# Altium project HW_Z-BAND_SMART_AMP_R1.PrjPcb (part 3 of 4)

## Sheet 09_USB.SchDoc: =TitleParameter
size A3; Date: 6/12/2026; ApprovedBy: U.KAYACIK; CheckedBy: E. CAGLAV; DrawnBy: E. CAGLAV; Organization: ASISGUARD; Address1: Kemalpasa, Kemalpasa Cd. No:290 D:292H, 35060 Bornova/Izmir/Turkey; Revision: R1; SheetNumber: 9; SheetTotal: 12
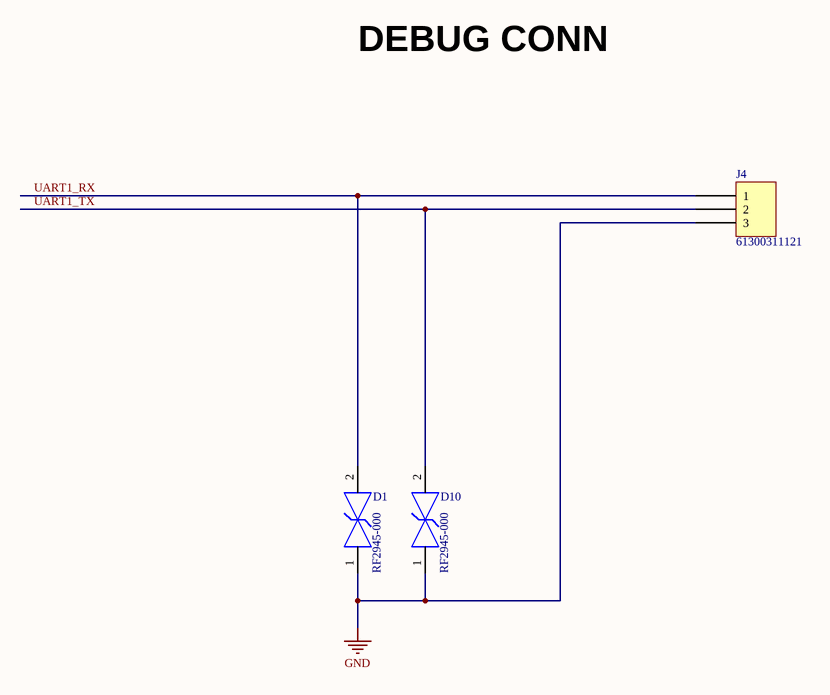
[diagram p8: 09_USB.SchDoc]

### Parts
D1  RF2945-000  [FP-SESD0402-MFG]
D10  RF2945-000  [FP-SESD0402-MFG]
J4  61300311121  [WURTH WE-PHD 61300311121]

### Nets
GND: D1.1 D10.1 J4.3
UART1_RX: D1.2 J4.1
UART1_TX: D10.2 J4.2

### Notes on the sheet
- DEBUG CONN
- Proje/Project:
- Sayfa Adı/Document Name:
- Çizilme Tarihi/Drawing Date
- E. CAGLAV
- Tasarlayan/Designed By
- Sayfa/Sheet:
- Revision:
- of
- Son Güncelleme/Last Edit Date
- Kontrol eden/Checked By
- Onaylayan/Approved By
- Boyut/Size:
- Varyant/Variant:
- Dil/Language:
- A3
- ENG

### Library data of the parts
D1 D10 = CMP-08607-000062-1: TVS DIODE 7V 10V 0402; Manufacturer: Littelfuse; Value: 0.1pF; Breakdown Voltage: 9.8V; Number Of Channels: 1; Peak Pulse Current: 2A; Direction: Bidirectional; Automotive Grade: Grade 1; Standoff Height: 0mm; Octopart: https://octopart.com/rf2945-000-littelfuse-56516902; Device Class L3: unset; ComponentLink2Description: Datasheet; Lead Free: Yes; Temperature Range Low: -55°C; Clamping Voltage: 10V; Digikey Description: TVS DIODE 7V 10V 0402; Category: Diode; Temperature: -55°C to +125°C; Device Class L1: Circuit Protection; Capacitance: 0.1pF; RoHS: TRUE; Device Class L2: TVS Diodes; Package: SESD0402; Reverse Standoff Voltage: 7V; Automotive: Yes; Height: 0.43mm; Manufacturer Part Number: RF2945-000; Temperature Range High: +125°C; ComponentLink2URL: https://www.littelfuse.com/~/media/electronics/datasheets/tvs_diode_arrays/littelfuse_tvs_diode_array_sesd_ultra_low_capacitance_discrete_tvs_datasheet.pdf.pdf
J4 = 61300311121: CONN HEADER VERT 3POS 2.54MM; Manufacturer: Würth Elektronik; Contact Length - Mating: 0.236" (6.00mm); Contact Length - Post: 0.118" (3.00mm); Current Rating (Amps): 3A; Material Flammability Rating: UL94 V-0; Number of Positions: 3; Number of Positions Loaded: All; Overall Contact Length: 0.454" (11.54mm); Pitch - Mating: 0.100" (2.54mm); Row Spacing - Mating: -40°C ~ 105°C; Shrouding: Unshrouded; Style: Board to Board or Cable; Part Number: 61300311121; ComponentLink1Description: Datasheet; ComponentLink1URL: https://katalog.we-online.de/em/datasheet/6130xx11121.pdf; ComponentLink2Description: DigiKey Link; ComponentLink2URL: https://www.digikey.com/en/products/detail/würth-elektronik/61300311121/4846825; Connector Type: Header; Contact Finish - Mating: Gold; Contact Material: Copper Alloy; Contact Shape: Square; Contact Type: Male Pin; Fastening Type: Push-Pull; Insulation Color: Black; Insulation Height: 0.100" (2.54mm); Insulation Material: Polyamide (PA6T), Nylon 6T; LastUpdated: 10/18/2024 1:43:15 PM; Lifecycle Status: Active; Minimum Order: 1; Mounting Type: Through Hole; Number of Rows: 1; Operating Temperature: -40°C ~ 105°C; Packaging: Bulk; PartId: 189; Part Status: Active; Price: 0.07; Series: WR-PHD; Supplier 1: DigiKey; Supplier Part Number 1: 732-5316-ND; Termination: Solder

## Sheet 10_RF_1.SchDoc: =TitleParameter
size A2; Date: 6/12/2026; ApprovedBy: U.KAYACIK; CheckedBy: E. CAGLAV; DrawnBy: E. CAGLAV; Revision: R1; SheetNumber: 10; SheetTotal: 12
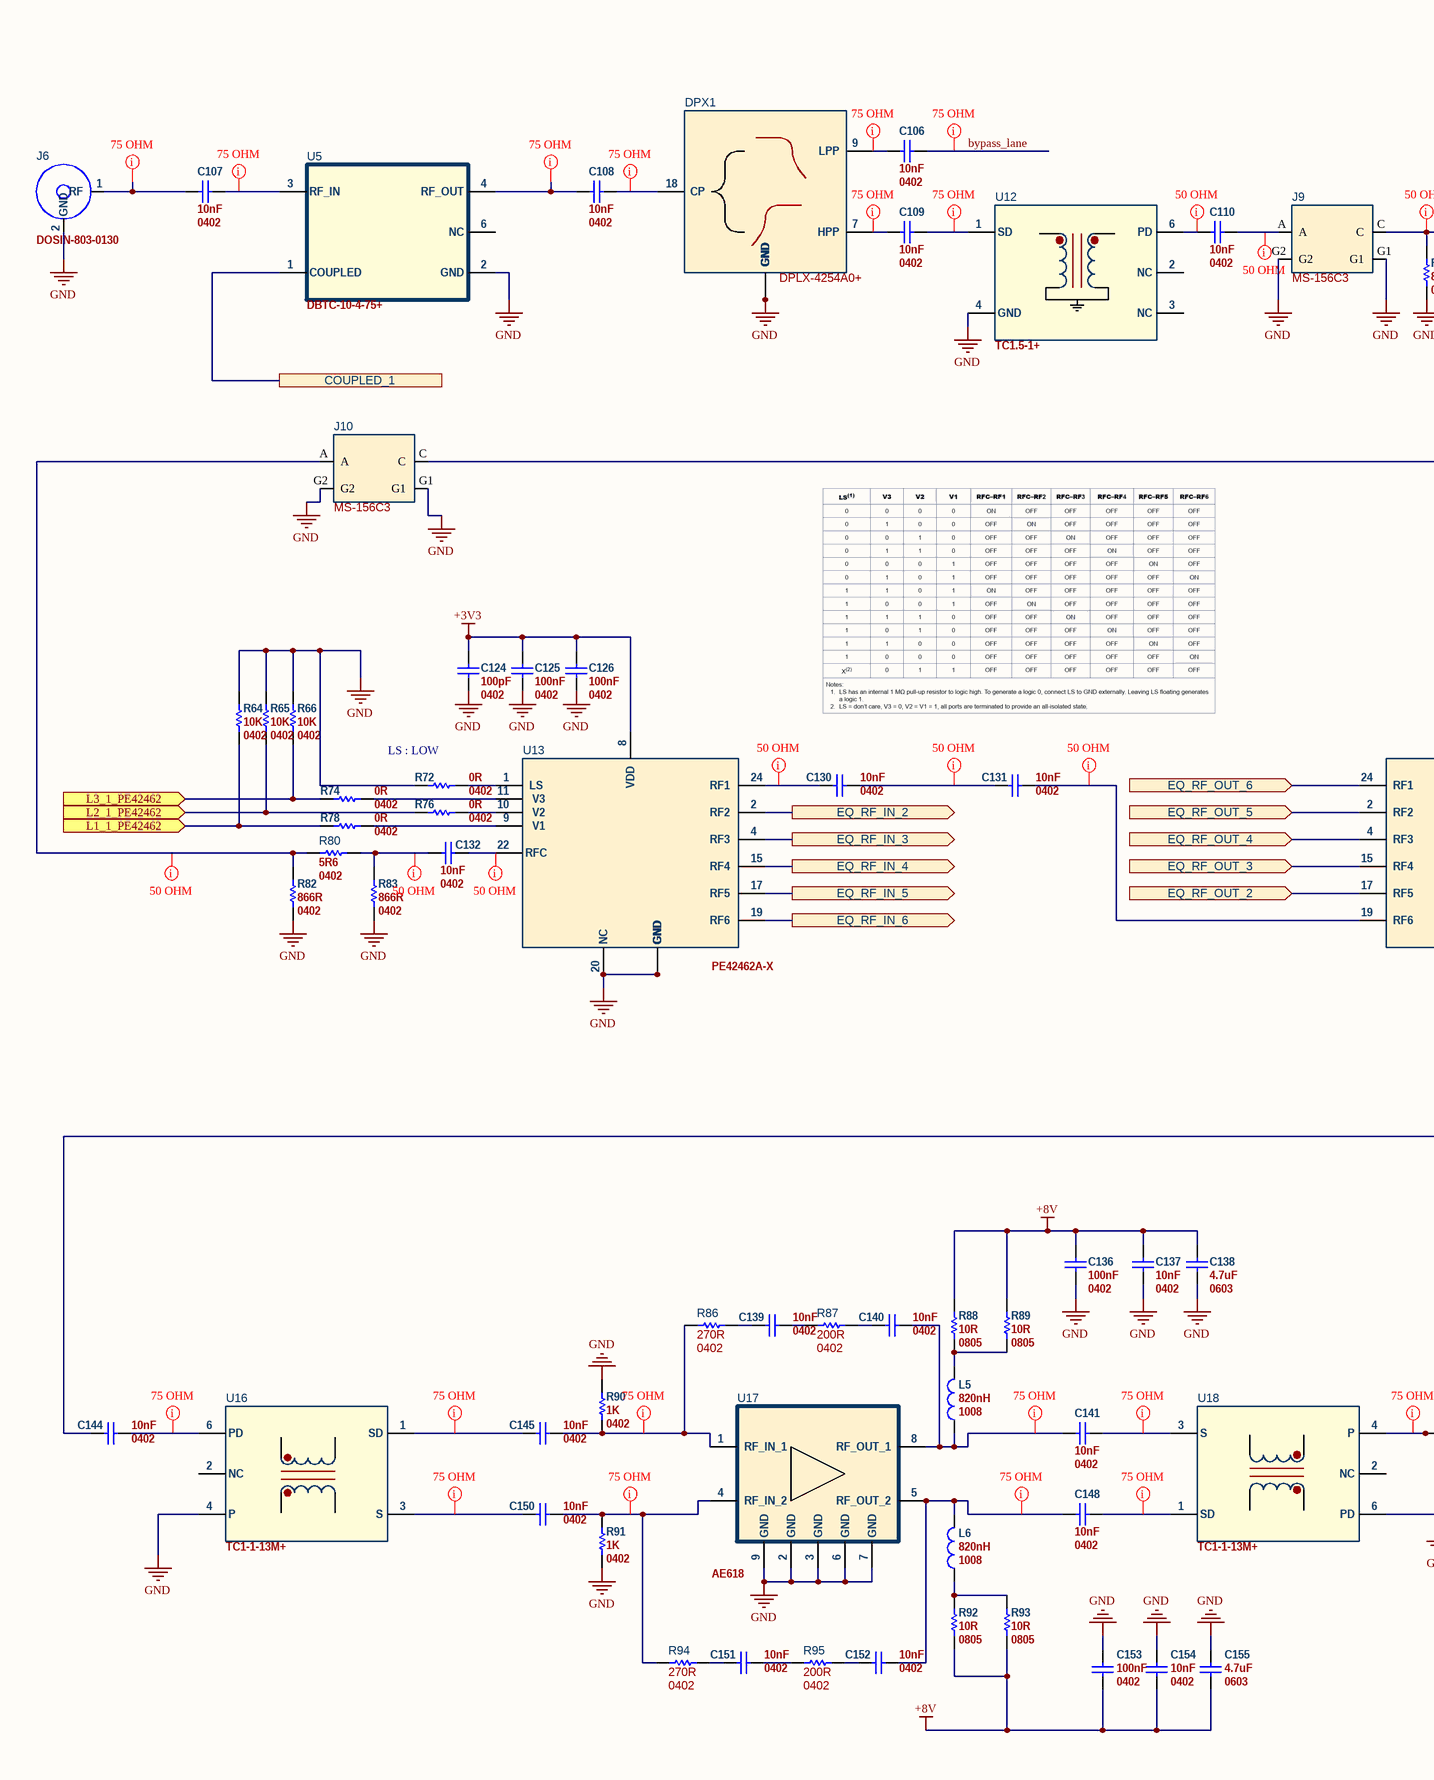
[diagram p9: 10_RF_1.SchDoc, left]
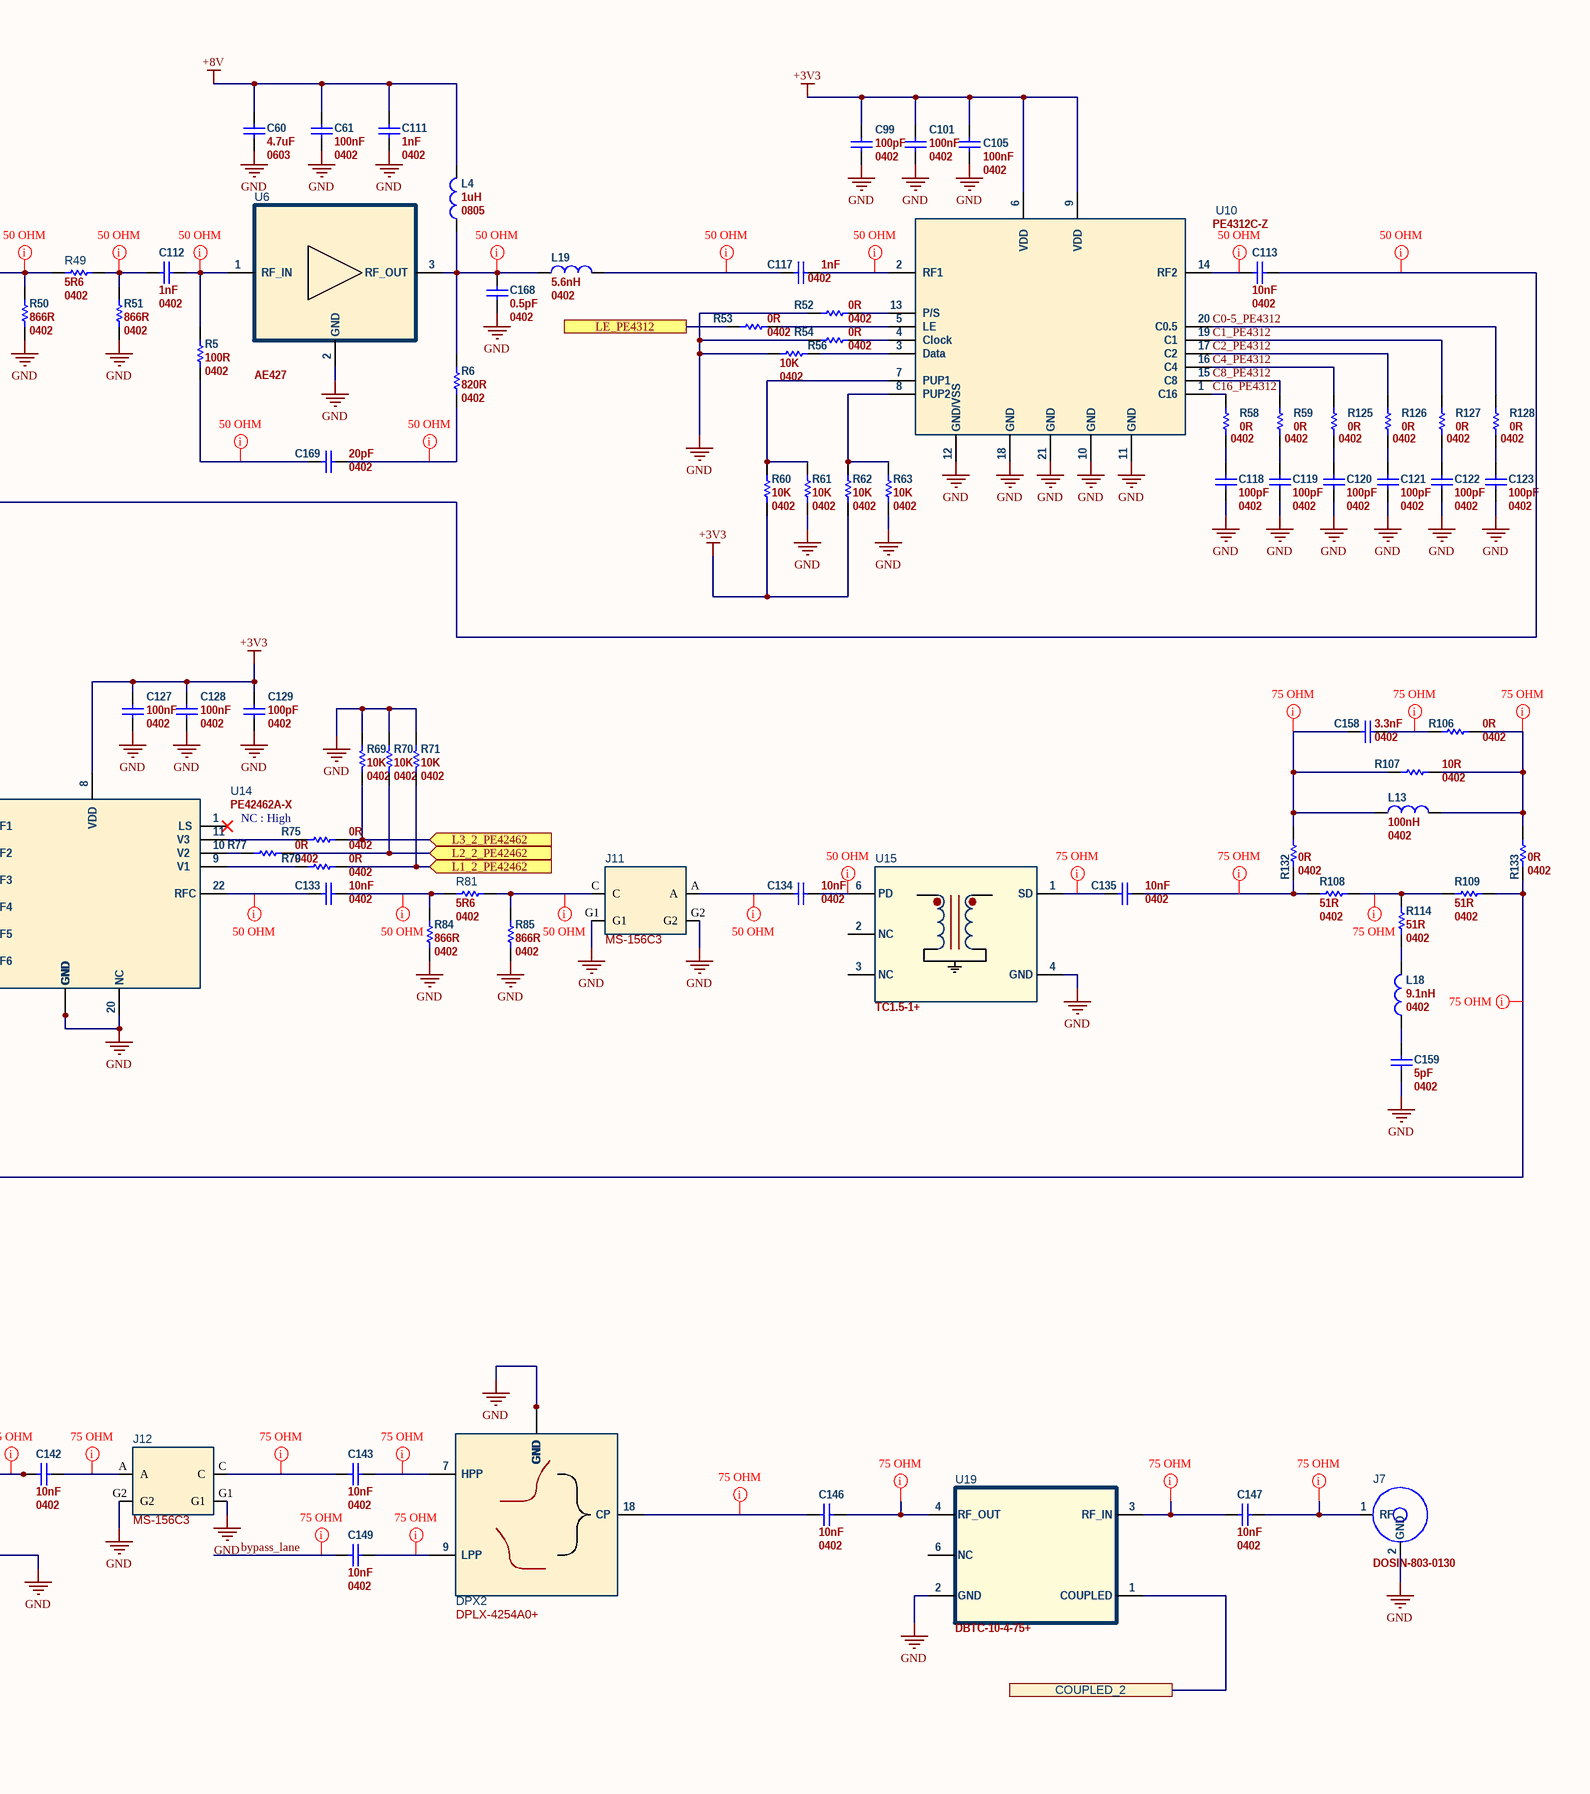
[diagram p10: 10_RF_1.SchDoc, right]

### Parts
C60  value 4.7uF  Package: 0603  [CAP_0603_N]  (hidden comment: C 0603 16V X7R - 4.7uF)
C61  value 100nF  Package: 0402  [CAP_0402_N]  (hidden comment: C 0402 50V X7R - 100nF)
C99  value 100pF  Package: 0402  [CAP_0402_N]  (hidden comment: C 0402 50V NP0 - 100pF)
C101  value 100nF  Package: 0402  [CAP_0402_N]  (hidden comment: C 0402 50V X7R - 100nF)
C105  value 100nF  Package: 0402  [CAP_0402_N]  (hidden comment: C 0402 50V X7R - 100nF)
C106  value 10nF  Package: 0402  [CAP_0402_N]  (hidden comment: C 0402 50V X7R - 10nF)
C107  value 10nF  Package: 0402  [CAP_0402_N]  (hidden comment: C 0402 50V X7R - 10nF)
C108  value 10nF  Package: 0402  [CAP_0402_N]  (hidden comment: C 0402 50V X7R - 10nF)
C109  value 10nF  Package: 0402  [CAP_0402_N]  (hidden comment: C 0402 50V X7R - 10nF)
C110  value 10nF  Package: 0402  [CAP_0402_N]  (hidden comment: C 0402 50V X7R - 10nF)
C111  value 1nF  Package: 0402  [CAP_0402_N]  (hidden comment: C 0402 50V X7R - 1nF)
C112  value 1nF  Package: 0402  [CAP_0402_N]  (hidden comment: C 0402 50V X7R - 1nF)
C113  value 10nF  Package: 0402  [CAP_0402_N]  (hidden comment: C 0402 50V X7R - 10nF)
C117  value 1nF  Package: 0402  [CAP_0402_N]  (hidden comment: C 0402 50V X7R - 1nF)
C118  value 100pF  Package: 0402  [CAP_0402_N]  (hidden comment: C 0402 50V NP0 - 100pF)
C119  value 100pF  Package: 0402  [CAP_0402_N]  (hidden comment: C 0402 50V NP0 - 100pF)
C120  value 100pF  Package: 0402  [CAP_0402_N]  (hidden comment: C 0402 50V NP0 - 100pF)
C121  value 100pF  Package: 0402  [CAP_0402_N]  (hidden comment: C 0402 50V NP0 - 100pF)
C122  value 100pF  Package: 0402  [CAP_0402_N]  (hidden comment: C 0402 50V NP0 - 100pF)
C123  value 100pF  Package: 0402  [CAP_0402_N]  (hidden comment: C 0402 50V NP0 - 100pF)
C124  value 100pF  Package: 0402  [CAP_0402_N]  (hidden comment: C 0402 50V NP0 - 100pF)
C125  value 100nF  Package: 0402  [CAP_0402_N]  (hidden comment: C 0402 50V X7R - 100nF)
C126  value 100nF  Package: 0402  [CAP_0402_N]  (hidden comment: C 0402 50V X7R - 100nF)
C127  value 100nF  Package: 0402  [CAP_0402_N]  (hidden comment: C 0402 50V X7R - 100nF)
C128  value 100nF  Package: 0402  [CAP_0402_N]  (hidden comment: C 0402 50V X7R - 100nF)
C129  value 100pF  Package: 0402  [CAP_0402_N]  (hidden comment: C 0402 50V NP0 - 100pF)
C130  value 10nF  Package: 0402  [CAP_0402_N]  (hidden comment: C 0402 50V X7R - 10nF)
C131  value 10nF  Package: 0402  [CAP_0402_N]  (hidden comment: C 0402 50V X7R - 10nF)
C132  value 10nF  Package: 0402  [CAP_0402_N]  (hidden comment: C 0402 50V X7R - 10nF)
C133  value 10nF  Package: 0402  [CAP_0402_N]  (hidden comment: C 0402 50V X7R - 10nF)
C134  value 10nF  Package: 0402  [CAP_0402_N]  (hidden comment: C 0402 50V X7R - 10nF)
C135  value 10nF  Package: 0402  [CAP_0402_N]  (hidden comment: C 0402 50V X7R - 10nF)
C136  value 100nF  Package: 0402  [CAP_0402_N]  (hidden comment: C 0402 50V X7R - 100nF)
C137  value 10nF  Package: 0402  [CAP_0402_N]  (hidden comment: C 0402 50V X7R - 10nF)
C138  value 4.7uF  Package: 0603  [CAP_0603_N]  (hidden comment: C 0603 16V X7R - 4.7uF)
C139  value 10nF  Package: 0402  [CAP_0402_N]  (hidden comment: C 0402 50V X7R - 10nF)
C140  value 10nF  Package: 0402  [CAP_0402_N]  (hidden comment: C 0402 50V X7R - 10nF)
C141  value 10nF  Package: 0402  [CAP_0402_N]  (hidden comment: C 0402 50V X7R - 10nF)
C142  value 10nF  Package: 0402  [CAP_0402_N]  (hidden comment: C 0402 50V X7R - 10nF)
C143  value 10nF  Package: 0402  [CAP_0402_N]  (hidden comment: C 0402 50V X7R - 10nF)
C144  value 10nF  Package: 0402  [CAP_0402_N]  (hidden comment: C 0402 50V X7R - 10nF)
C145  value 10nF  Package: 0402  [CAP_0402_N]  (hidden comment: C 0402 50V X7R - 10nF)
C146  value 10nF  Package: 0402  [CAP_0402_N]  (hidden comment: C 0402 50V X7R - 10nF)
C147  value 10nF  Package: 0402  [CAP_0402_N]  (hidden comment: C 0402 50V X7R - 10nF)
C148  value 10nF  Package: 0402  [CAP_0402_N]  (hidden comment: C 0402 50V X7R - 10nF)
C149  value 10nF  Package: 0402  [CAP_0402_N]  (hidden comment: C 0402 50V X7R - 10nF)
C150  value 10nF  Package: 0402  [CAP_0402_N]  (hidden comment: C 0402 50V X7R - 10nF)
C151  value 10nF  Package: 0402  [CAP_0402_N]  (hidden comment: C 0402 50V X7R - 10nF)
C152  value 10nF  Package: 0402  [CAP_0402_N]  (hidden comment: C 0402 50V X7R - 10nF)
C153  value 100nF  Package: 0402  [CAP_0402_N]  (hidden comment: C 0402 50V X7R - 100nF)
C154  value 10nF  Package: 0402  [CAP_0402_N]  (hidden comment: C 0402 50V X7R - 10nF)
C155  value 4.7uF  Package: 0603  [CAP_0603_N]  (hidden comment: C 0603 16V X7R - 4.7uF)
C158  value 3.3nF  Package: 0402  [CAP_0402_N]  (hidden comment: C 0402 50V X7R - 3.3nF)
C159  value 5pF  Package: 0402  [CAP_0402_N]  (hidden comment: C 0402 50V C0G/NP0 - 5pF)
C168  value 0.5pF  Package: 0402  [CAP_0402_N]  (hidden comment: C 0402 50V C0G/NP0 - 0.5pF)
C169  value 20pF  Package: 0402  [CAP_0402_N]  (hidden comment: C 0402 50V C0G/NP0 - 20pF)
DPX1  DPLX-4254A0+  [NU-1620]
DPX2  DPLX-4254A0+  [NU-1620]
J6  DOSIN-803-0130  [1211-66137]
J7  DOSIN-803-0130  [1211-66137]
J9  MS-156C3  [HIROSE_MS-156C3]
J10  MS-156C3  [HIROSE_MS-156C3]
J11  MS-156C3  [HIROSE_MS-156C3]
J12  MS-156C3  [HIROSE_MS-156C3]
L4  value 1uH  Package: 0805  [IND_0806_LQH2MPN820MGRL]  (hidden comment: L 0805 800mA - 1uH)
L5  value 820nH  Package: 1008  [IND_1008_N]  (hidden comment: L 1008 400mA - 820nH)
L6  value 820nH  Package: 1008  [IND_1008_N]  (hidden comment: L 1008 400mA - 820nH)
L13  value 100nH  Package: 0402  [IND_0402_N]  (hidden comment: L 0402 310mA - 100nH)
L18  value 9.1nH  Package: 0402  [IND_0402_N]  (hidden comment: L 0402 1.6A - 9.1nH)
L19  value 5.6nH  Package: 0402  [IND_0402_N]  (hidden comment: L 0402 650mA - 5.6nH)
R5  value 100R  Package: 0402  [RES_0402_N]  (hidden comment: R 0402 1/10W 1% - 100R)
R6  value 820R  Package: 0402  [RES_0402_N]  (hidden comment: R 0402 1/10W 1% - 820R)
R49  value 5R6  Package: 0402  [RES_0402_N]  (hidden comment: R 0402 1/10W 1% - 5R6)
R50  value 866R  Package: 0402  [RES_0402_N]  (hidden comment: R 0402 1/10W 1% - 866R)
R51  value 866R  Package: 0402  [RES_0402_N]  (hidden comment: R 0402 1/10W 1% - 866R)
R52  value 0R  Package: 0402  [RES_0402_N]  (hidden comment: R 0402 1/10W - 0R)
R53  value 0R  Package: 0402  [RES_0402_N]  (hidden comment: R 0402 1/10W - 0R)
R54  value 0R  Package: 0402  [RES_0402_N]  (hidden comment: R 0402 1/10W - 0R)
R56  value 10K  Package: 0402  [RES_0402_N]  (hidden comment: R 0402 1/10W 1% - 10K)
R58  value 0R  Package: 0402  [RES_0402_N]  (hidden comment: R 0402 1/10W - 0R)
R59  value 0R  Package: 0402  [RES_0402_N]  (hidden comment: R 0402 1/10W - 0R)
R60  value 10K  Package: 0402  [RES_0402_N]  (hidden comment: R 0402 1/10W 1% - 10K)
R61  value 10K  Package: 0402  [RES_0402_N]  (hidden comment: R 0402 1/10W 1% - 10K)
R62  value 10K  Package: 0402  [RES_0402_N]  (hidden comment: R 0402 1/10W 1% - 10K)
R63  value 10K  Package: 0402  [RES_0402_N]  (hidden comment: R 0402 1/10W 1% - 10K)
R64  value 10K  Package: 0402  [RES_0402_N]  (hidden comment: R 0402 1/10W 1% - 10K)
R65  value 10K  Package: 0402  [RES_0402_N]  (hidden comment: R 0402 1/10W 1% - 10K)
R66  value 10K  Package: 0402  [RES_0402_N]  (hidden comment: R 0402 1/10W 1% - 10K)
R69  value 10K  Package: 0402  [RES_0402_N]  (hidden comment: R 0402 1/10W 1% - 10K)
R70  value 10K  Package: 0402  [RES_0402_N]  (hidden comment: R 0402 1/10W 1% - 10K)
R71  value 10K  Package: 0402  [RES_0402_N]  (hidden comment: R 0402 1/10W 1% - 10K)
R72  value 0R  Package: 0402  [RES_0402_N]  (hidden comment: R 0402 1/10W - 0R)
R74  value 0R  Package: 0402  [RES_0402_N]  (hidden comment: R 0402 1/10W - 0R)
R75  value 0R  Package: 0402  [RES_0402_N]  (hidden comment: R 0402 1/10W - 0R)
R76  value 0R  Package: 0402  [RES_0402_N]  (hidden comment: R 0402 1/10W - 0R)
R77  value 0R  Package: 0402  [RES_0402_N]  (hidden comment: R 0402 1/10W - 0R)
R78  value 0R  Package: 0402  [RES_0402_N]  (hidden comment: R 0402 1/10W - 0R)
R79  value 0R  Package: 0402  [RES_0402_N]  (hidden comment: R 0402 1/10W - 0R)
R80  value 5R6  Package: 0402  [RES_0402_N]  (hidden comment: R 0402 1/10W 1% - 5R6)
R81  value 5R6  Package: 0402  [RES_0402_N]  (hidden comment: R 0402 1/10W 1% - 5R6)
R82  value 866R  Package: 0402  [RES_0402_N]  (hidden comment: R 0402 1/10W 1% - 866R)
R83  value 866R  Package: 0402  [RES_0402_N]  (hidden comment: R 0402 1/10W 1% - 866R)
R84  value 866R  Package: 0402  [RES_0402_N]  (hidden comment: R 0402 1/10W 1% - 866R)
R85  value 866R  Package: 0402  [RES_0402_N]  (hidden comment: R 0402 1/10W 1% - 866R)
R86  value 270R  Package: 0402  [RES_0402_N]  (hidden comment: R 0402 1/10W 1% - 270R)
R87  value 200R  Package: 0402  [RES_0402_N]  (hidden comment: R 0402 1/10W 1% - 200R)
R88  value 10R  Package: 0805  [RES_0805_N]  (hidden comment: R 0805 1/2W 1% - 10R)
R89  value 10R  Package: 0805  [RES_0805_N]  (hidden comment: R 0805 1/2W 1% - 10R)
R90  value 1K  Package: 0402  [RES_0402_N]  (hidden comment: R 0402 1/10W 1% - 1K)
R91  value 1K  Package: 0402  [RES_0402_N]  (hidden comment: R 0402 1/10W 1% - 1K)
R92  value 10R  Package: 0805  [RES_0805_N]  (hidden comment: R 0805 1/2W 1% - 10R)
R93  value 10R  Package: 0805  [RES_0805_N]  (hidden comment: R 0805 1/2W 1% - 10R)
R94  value 270R  Package: 0402  [RES_0402_N]  (hidden comment: R 0402 1/10W 1% - 270R)
R95  value 200R  Package: 0402  [RES_0402_N]  (hidden comment: R 0402 1/10W 1% - 200R)
R106  value 0R  Package: 0402  [RES_0402_N]  (hidden comment: R 0402 1/10W - 0R)
R107  value 10R  Package: 0402  [RES_0402_N]  (hidden comment: R 0402 1/10W 1% - 10R)
R108  value 51R  Package: 0402  [RES_0402_N]  (hidden comment: R 0402 1/10W 1% - 51R)
R109  value 51R  Package: 0402  [RES_0402_N]  (hidden comment: R 0402 1/10W 1% - 51R)
R114  value 51R  Package: 0402  [RES_0402_N]  (hidden comment: R 0402 1/10W 1% - 51R)
R125  value 0R  Package: 0402  [RES_0402_N]  (hidden comment: R 0402 1/10W - 0R)
R126  value 0R  Package: 0402  [RES_0402_N]  (hidden comment: R 0402 1/10W - 0R)
R127  value 0R  Package: 0402  [RES_0402_N]  (hidden comment: R 0402 1/10W - 0R)
R128  value 0R  Package: 0402  [RES_0402_N]  (hidden comment: R 0402 1/10W - 0R)
R132  value 0R  Package: 0402  [RES_0402_N]  (hidden comment: R 0402 1/10W - 0R)
R133  value 0R  Package: 0402  [RES_0402_N]  (hidden comment: R 0402 1/10W - 0R)
U5  DBTC-10-4-75+  [AT790-1]
U6  AE427  [SOT89]
U10  PE4312C-Z  [QFN_20_PE4312]
U12  TC1.5-1+  [AT1521]
U13  PE42462A-X  [24_LFCSP(CP-24-8)]
U14  PE42462A-X  [24_LFCSP(CP-24-8)]
U15  TC1.5-1+  [AT1521]
U16  TC1-1-13M+  [AT1521]
U17  AE618  [SOIC-8N_EP]
U18  TC1-1-13M+  [AT1521]
U19  DBTC-10-4-75+  [AT790-1]

### Ports
COUPLED_1, COUPLED_2, EQ_RF_IN_2 (out), EQ_RF_IN_3 (out), EQ_RF_IN_4 (out), EQ_RF_IN_5 (out), EQ_RF_IN_6 (out), EQ_RF_OUT_2 (in), EQ_RF_OUT_3 (in), EQ_RF_OUT_4 (in), EQ_RF_OUT_5 (in), EQ_RF_OUT_6 (in), L1_1_PE42462 (in), L1_2_PE42462 (in), L2_1_PE42462 (in), L2_2_PE42462 (in), L3_1_PE42462 (in), L3_2_PE42462 (in), LE_PE4312

### Nets
+3V3: C99.2 C101.2 C105.2 C124.2 C125.2 C126.2 C127.2 C128.2 C129.2 R60.1 R62.1 U10.6(VDD) U10.9(VDD) U13.8(VDD) U14.8(VDD)
+8V: C60.2 C61.2 C111.2 C136.2 C137.1 C138.1 C153.1 C154.2 C155.1 L4.2 R88.2 R89.2 R92.1 R93.1
GND: C60.1 C61.1 C99.1 C101.1 C105.1 C111.1 C118.1 C119.1 C120.1 C121.1 C122.1 C123.1 C124.1 C125.1 C126.1 C127.1 C128.1 C129.1 C136.1 C137.2 C138.2 C153.2 C154.1 C155.2 C159.1 C168.1 DPX1.1(GND) DPX1.2(GND) DPX1.3(GND) DPX1.4(GND) DPX1.5(GND) DPX1.6(GND) DPX1.8(GND) DPX1.10(GND) DPX1.11(GND) DPX1.12(GND) DPX1.13(GND) DPX1.14(GND) DPX1.15(GND) DPX1.16(GND) DPX1.17(GND) DPX1.19(GND) DPX2.1(GND) DPX2.2(GND) DPX2.3(GND) DPX2.4(GND) DPX2.5(GND) DPX2.6(GND) DPX2.8(GND) DPX2.10(GND) DPX2.11(GND) DPX2.12(GND) DPX2.13(GND) DPX2.14(GND) DPX2.15(GND) DPX2.16(GND) DPX2.17(GND) DPX2.19(GND) J6.2(GND) J7.2(GND) J9.G1 J9.G2 J10.G1 J10.G2 J11.G1 J11.G2 J12.G1 J12.G2 R50.1 R51.1 R52.1 R54.1 R56.2 R61.1 R63.1 R64.1 R65.1 R66.1 R69.1 R70.1 R71.1 R72.1 R82.1 R83.1 R84.1 R85.1 R90.2 R91.1 U5.2(GND) U6.2(GND) U10.10(GND) U10.11(GND) U10.12(GND/VSS) U10.18(GND) U10.21(GND) U12.4(GND) U13.3(GND) U13.5(GND) U13.6(GND) U13.7(GND) U13.12(GND) U13.13(GND) U13.14(GND) U13.16(GND) U13.18(GND) U13.20(NC) U13.21(GND) U13.23(GND) U13.25(GND) U14.3(GND) U14.5(GND) U14.6(GND) U14.7(GND) U14.12(GND) U14.13(GND) U14.14(GND) U14.16(GND) U14.18(GND) U14.20(NC) U14.21(GND) U14.23(GND) U14.25(GND) U15.4(GND) U16.4(P) U17.2(GND) U17.3(GND) U17.6(GND) U17.7(GND) U17.9(GND) U18.6(PD) U19.2(GND)
bypass_lane: C106.2 C149.2
C0-5_PE4312: R128.2 U10.20(C0.5)
C1_PE4312: R127.2 U10.19(C1)
C2_PE4312: R126.2 U10.17(C2)
C4_PE4312: R125.2 U10.16(C4)
C8_PE4312: R59.2 U10.15(C8)
C16_PE4312: R58.2 U10.1(C16)
L1_1_PE42462: R64.2 R78.1 ; port L1_1_PE42462
L2_1_PE42462: R65.2 R76.1 ; port L2_1_PE42462
L3_1_PE42462: R66.2 R74.1 ; port L3_1_PE42462
NetC106_1: C106.1 DPX1.9(LPP)
NetC107_1: C107.1 J6.1(RF)
NetC107_2: C107.2 U5.3(RF_IN)
NetC108_1: C108.1 U5.4(RF_OUT)
NetC108_2: C108.2 DPX1.18(CP)
NetC109_1: C109.1 DPX1.7(HPP)
NetC109_2: C109.2 U12.1(SD)
NetC110_1: C110.1 U12.6(PD)
NetC110_2: C110.2 J9.A
NetC112_1: C112.1 R49.2 R51.2
NetC112_2: C112.2 R5.2 U6.1(RF_IN)
NetC113_1: C113.1 U10.14(RF2)
NetC113_2: C113.2 J10.C
NetC117_1: C117.1 L19.2
NetC117_2: C117.2 U10.2(RF1)
NetC118_2: C118.2 R58.1
NetC119_2: C119.2 R59.1
NetC120_2: C120.2 R125.1
NetC121_2: C121.2 R126.1
NetC122_2: C122.2 R127.1
NetC123_2: C123.2 R128.1
NetC130_1: C130.1 U13.24(RF1)
NetC130_2: C130.2 C131.2
NetC131_1: C131.1 U14.19(RF6)
NetC132_1: C132.1 R80.2 R83.2
NetC132_2: C132.2 U13.22(RFC)
NetC133_1: C133.1 U14.22(RFC)
NetC133_2: C133.2 R81.1 R84.2
NetC134_1: C134.1 J11.A
NetC134_2: C134.2 U15.6(PD)
NetC135_1: C135.1 U15.1(SD)
NetC135_2: C135.2 R108.1 R132.1
NetC139_1: C139.1 R86.2
NetC139_2: C139.2 R87.1
NetC140_1: C140.1 R87.2
NetC140_2: C140.2 C141.2 L5.1 U17.8(RF_OUT_1)
NetC141_1: C141.1 U18.3(S)
NetC142_1: C142.1 J12.A
NetC142_2: C142.2 U18.4(P)
NetC143_1: C143.1 DPX2.7(HPP)
NetC143_2: C143.2 J12.C
NetC144_1: C144.1 R109.2 R133.1
NetC144_2: C144.2 U16.6(PD)
NetC145_1: C145.1 U16.1(SD)
NetC145_2: C145.2 R86.1 R90.1 U17.1(RF_IN_1)
NetC146_1: C146.1 U19.4(RF_OUT)
NetC146_2: C146.2 DPX2.18(CP)
NetC147_1: C147.1 J7.1(RF)
NetC147_2: C147.2 U19.3(RF_IN)
NetC148_1: C148.1 U18.1(SD)
NetC148_2: C148.2 C152.2 L6.2 U17.5(RF_OUT_2)
NetC149_1: C149.1 DPX2.9(LPP)
NetC150_1: C150.1 U16.3(S)
NetC150_2: C150.2 R91.2 R94.1 U17.4(RF_IN_2)
NetC151_1: C151.1 R94.2
NetC151_2: C151.2 R95.1
NetC152_1: C152.1 R95.2
NetC158_1: C158.1 L13.1 R107.1 R132.2
NetC158_2: C158.2 R106.1
NetC159_2: C159.2 L18.1
NetC164_1: U13.2(RF2) ; port EQ_RF_IN_2
NetC165_2: U14.17(RF5) ; port EQ_RF_OUT_2
NetC166_1: U13.15(RF4) ; port EQ_RF_IN_4
NetC167_2: U14.4(RF3) ; port EQ_RF_OUT_4
NetC168_2: C168.2 L4.1 L19.1 R6.2 U6.3(RF_OUT)
NetC169_1: C169.1 R5.1
NetC169_2: C169.2 R6.1
NetC172_1: U13.4(RF3) ; port EQ_RF_IN_3
NetC174_1: U13.17(RF5) ; port EQ_RF_IN_5
NetC175_2: U14.2(RF2) ; port EQ_RF_OUT_5
NetC176_2: U14.15(RF4) ; port EQ_RF_OUT_3
NetC188_1: U13.19(RF6) ; port EQ_RF_IN_6
NetC189_2: U14.24(RF1) ; port EQ_RF_OUT_6
NetJ9_C: J9.C R49.1 R50.2
NetJ10_A: J10.A R80.1 R82.2
NetJ11_C: J11.C R81.2 R85.2
NetL5_2: L5.2 R88.1 R89.1
NetL6_1: L6.1 R92.2 R93.2
NetL13_2: L13.2 R106.2 R107.2 R133.2
NetL18_2: L18.2 R114.1
NetR52_2: R52.2 U10.13(P/S)
NetR53_1: R53.1 ; port LE_PE4312
NetR53_2: R53.2 U10.5(LE)
NetR54_2: R54.2 U10.4(Clock)
NetR56_1: R56.1 U10.3(Data)
NetR60_2: R60.2 R61.2 U10.7(PUP1)
NetR62_2: R62.2 R63.2 U10.8(PUP2)
NetR69_2: R69.2 R75.2 ; port L3_2_PE42462
NetR70_2: R70.2 R77.2 ; port L2_2_PE42462
NetR71_2: R71.2 R79.2 ; port L1_2_PE42462
NetR72_2: R72.2 U13.1(LS)
NetR74_2: R74.2 U13.11(V3)
NetR75_1: R75.1 U14.11(V3)
NetR76_2: R76.2 U13.10(V2)
NetR77_1: R77.1 U14.10(V2)
NetR78_2: R78.2 U13.9(V1)
NetR79_1: R79.1 U14.9(V1)
NetR108_2: R108.2 R109.1 R114.2
NetU5_1: U5.1(COUPLED) ; port COUPLED_1
NetU19_1: U19.1(COUPLED) ; port COUPLED_2

Not connected (* = marked no-connect by the designer): U5 6(NC); U12 2(NC) 3(NC); U14 1(LS)*; U15 2(NC) 3(NC); U16 2(NC); U18 2(NC); U19 6(NC)

### Layout directives
net class RF_75_OHM; rule Width Constraint [Pref Impedance = 50.00ohms    Min Impedance = 50.00ohms    Max Impedance = 50.00ohms]: bypass_lane, NetC106_1, NetC107_1, NetC107_2, NetC108_1, NetC108_2, NetC109_1, NetC109_2, NetC135_1, NetC135_2, NetC140_2, NetC141_1, NetC142_1, NetC142_2, NetC143_1, NetC143_2, NetC144_1, NetC144_2, NetC145_1, NetC145_2, NetC146_1, NetC146_2, NetC147_1, NetC147_2, NetC148_1, NetC148_2, NetC149_1, NetC150_1, NetC150_2, NetC158_1, NetC158_2, NetL13_2, NetR108_2
net class RF_50_OHM; rule Width Constraint [Pref Impedance = 50.00ohms    Min Impedance = 50.00ohms    Max Impedance = 50.00ohms]: NetC110_1, NetC110_2, NetC112_1, NetC112_2, NetC113_1, NetC113_2, NetC117_1, NetC117_2, NetC130_1, NetC130_2, NetC131_1, NetC132_1, NetC132_2, NetC133_1, NetC133_2, NetC134_1, NetC134_2, NetC168_2, NetC169_1, NetC169_2, NetJ9_C, NetJ10_A, NetJ11_C

### Notes on the sheet
- (near R72) LS : LOW
- NC : High
- Proje/Project:
- Sayfa Adı/Document Name:
- Çizilme Tarihi/Drawing Date
- Son Güncelleme/Last Edit Date
- E. CAGLAV
- Tasarlayan/Designed By
- Kontrol eden/Checked By
- Boyut/Size:
- Sayfa/Sheet:
- Revision:
- A3
- of
- Onaylayan/Approved By
- Varyant/Variant:
- Dil/Language:
- ENG

### Library data of the parts
C60 C138 C155 = C 0603 16V X7R - 4.7uF: CAP CER 4.7uF 16V X7R 0603 ±10%; Manufacturer 1: MURATA ELECTRONICS; Manufacturer Part Number 1: GRM188Z71C475KE21D; Location: NA; MSL Level: Level-1; MaxHeight_mm: 0.95; Check: Approved; UnitPrice: 0.28; PackageType: SMD; Tolerance: ±10%; ComponentLink2Description: Datasheet; ComponentLink2URL: D:\SAVRONIK_SVN\Donanım\trunk\ALTIUM\Central Library\Datasheets\Capacitor\GRM188Z71C475KE21-01A_Datasheet.pdf; Status: Active; ComponentLink1Description: DigiKey; ComponentLink1URL: https://www.digikey.com/en/products/detail/murata-electronics/GRM188Z71C475KE21D/13401930; Supplier 1: Digikey; Supplier Part Number 1: 490-GRM188Z71C475KE21DTR-ND
C61 C101 C105 C125-C128 C136 C153 = C 0402 50V X7R - 100nF: CAP CER 100nF 50V X7R 0402 ±10%; Manufacturer 1: TDK CORPORATION; Manufacturer Part Number 1: CGA2B3X7R1H104K050BB; Location: NA; MSL Level: Level-1; MaxHeight_mm: 0.55; Check: Approved; UnitPrice: 0.1; PackageType: SMD; Tolerance: ±10%; ComponentLink2Description: Datasheet; ComponentLink2URL: D:\SAVRONIK_SVN\Donanım\trunk\ALTIUM\Central Library\Datasheets\Capacitor\CGA2B3X7R1H104K050BB_Datasheet.pdf; Status: Active; ComponentLink3Description: DigiKey; ComponentLink3URL: https://www.digikey.com/en/products/detail/tdk-corporation/CGA2B3X7R1H104K050BB/2672792; Supplier 1: Digikey; Supplier Part Number 1: 445-6899-2-ND
C99 C118-C124 C129 = C 0402 50V NP0 - 100pF: CAP CER 100pF 50V NP0 0402 ±1%; Manufacturer 1: TDK; Manufacturer Part Number 1: C1005C0G1H101F050BA; Location: NA; MSL Level: Level-1; MaxHeight_mm: 0.55; M_Number_of_Pins: 2; M_RatedVoltage(V): 50; Check: Approved; UnitPrice: 0.1; PackageType: SMD; Tolerance: ±1%; ComponentLink2Description: Datasheet; Status: Active; ComponentLink3Description: DigiKey; ComponentLink3URL: https://www.digikey.com/en/products/detail/tdk-corporation/C1005C0G1H101F050BA/2269856?s=N4IgTCBcDaIMIEYAMSCsckHEEAlkIDE0kAhAQRAF0BfIA; M_AmpersPerContact: NA; M_Duty Cycle(%): NA; M_MatingCycle: NA; M_Number_of_Bits(K): NA; M_Number_of_Transistors_Gates_or_Bits: NA; M_OperatingPower(W): NA; M_ProgrammingCycles: NA; M_RatedPower(W): NA; M_ThermalResistance(θJABC)(°C/W): NA; Supplier 1: Digi-Key; Supplier Part Number 1: 445-5362-2-ND
C106-C110 C113 C130-C135 C137 C139-C152 C154 = C 0402 50V X7R - 10nF: CAP CER 10nF 50V X7R 0402 ±10%; Manufacturer 1: KEMET; Manufacturer Part Number 1: C0402C103K5RAC7867; Location: NA; MSL Level: Level-1; MaxHeight_mm: 0.55; M_Number_of_Pins: 2; M_RatedVoltage(V): 50; Check: Approved; UnitPrice: 0.1; PackageType: SMD; Tolerance: ±10%; ComponentLink2Description: Datasheet; Status: Active; ComponentLink3Description: DigiKey; ComponentLink3URL: https://www.digikey.com/en/products/detail/kemet/C0402C103K5RAC7867/501968; M_AmpersPerContact: NA; M_Duty Cycle(%): NA; M_ESR(mΩ): NA; M_MatingCycle: NA; M_Number_of_Bits(K): NA; M_Number_of_Transistors_Gates_or_Bits: NA; M_OperatingPower(W): NA; M_ProgrammingCycles: NA; M_RatedPower(W): NA; M_ThermalResistance(θJABC)(°C/W): NA; Supplier 1: Digi-Key; Supplier Part Number 1: 399-C0402C103K5RAC7867TR-ND
C111 C112 C117 = C 0402 50V X7R - 1nF: CAP CER 1nF 50V X7R 0402 ±10%; Manufacturer 1: KEMET; Manufacturer Part Number 1: C0402C102K5RAC7867; Location: NA; MSL Level: Level-1; MaxHeight_mm: 0.65; Check: Approved; UnitPrice: 0.1; PackageType: SMD; Tolerance: ±10%; ComponentLink2Description: Datasheet; Status: Active; ComponentLink3Description: DigiKey; ComponentLink3URL: https://www.digikey.com/en/products/detail/kemet/C0402C102K5RAC7867/411034
C158 = C 0402 50V X7R - 3.3nF: CAP CER 3.3nF 50V X7R 0402 ±5%; Manufacturer 1: MURATA ELECTRONICS; Manufacturer Part Number 1: GRM155R71H332JA01D; Location: NA; MSL Level: Level-1; MaxHeight_mm: 0.55; M_Number_of_Pins: 2; Check: Approved; UnitPrice: 0.1; PackageType: SMD; Tolerance: ±5%; ComponentLink2Description: Datasheet; Status: Active; ComponentLink3Description: DigiKey; ComponentLink3URL: https://www.digikey.com/en/products/detail/murata-electronics/GRM155R71H332JA01D/5251319?utm_adgroup=&utm_source=google&utm_medium=cpc&utm_campaign=Pmax_Product_All%20Products&utm_term=&utm_content=&utm_id=go_cmp-18790247214_adg-_ad-__dev-c_ext-_prd-_sig-EAIaIQobChMI-qDC4avGhQMVhkVBAh32KAqJEAAYAiAAEgIqzvD_BwE&gad_source=1&gclid=EAIaIQobChMI-qDC4avGhQMVhkVBAh32KAqJEAAYAiAAEgIqzvD_BwE; M_AmpersPerContact: NA; M_Duty Cycle(%): NA; M_MatingCycle: NA; M_Number_of_Bits(K): NA; M_Number_of_Transistors_Gates_or_Bits: NA; M_OperatingPower(W): NA; M_ProgrammingCycles: NA; M_RatedPower(W): NA; M_RatedVoltage(V): 50V; M_ThermalResistance(θJABC)(°C/W): NA; Supplier 1: Digi-Key; Supplier Part Number 1: 490-10780-2-ND
C159 = C 0402 50V C0G/NP0 - 5pF: CAP CER 5pF 50V C0G/NP0 0402 ±0.1pF; Manufacturer 1: MURATA; Manufacturer Part Number 1: GJM1555C1H5R0BB01D; Location: NA; MSL Level: Level-1; MaxHeight_mm: 0.55; M_Number_of_Pins: 2; M_RatedVoltage(V): 50; Check: Approved; UnitPrice: 0.14; PackageType: SMD; Tolerance: ±0.1pF; ComponentLink2Description: Datasheet; Status: Active; ComponentLink3Description: DigiKey; ComponentLink3URL: https://www.digikey.com/en/products/detail/murata-electronics/GJM1555C1H5R0BB01D/2593016; M_AmpersPerContact: NA; M_Duty Cycle(%): NA; M_MatingCycle: NA; M_Number_of_Bits(K): NA; M_Number_of_Transistors_Gates_or_Bits: NA; M_OperatingPower(W): NA; M_ProgrammingCycles: NA; M_RatedPower(W): NA; M_ThermalResistance(θJABC)(°C/W): NA; Supplier 1: Digi-Key; Supplier Part Number 1: 490-8103-2-ND
C168 = C 0402 50V C0G/NP0 - 0.5pF: CAP CER 0.5pF 50V C0G/NP0 0402 ±0.1pF; Manufacturer 1: MURATA ELECTRONICS; Manufacturer Part Number 1: GJM1555C1HR50BB01J; Location: NA; MSL Level: Level-1; MaxHeight_mm: 0.55; Check: Approved; UnitPrice: 0.1; PackageType: SMD; Tolerance: ±0.1pF; ComponentLink2Description: Datasheet; Status: Active; ComponentLink3Description: DigiKey; ComponentLink3URL: https://www.digikey.com/en/products/detail/murata-electronics/GJM1555C1HR50BB01J/2593251; Supplier 1: Digi-Key; Supplier Part Number 1: 490-8105-2-ND
C169 = C 0402 50V C0G/NP0 - 20pF: CAP CER 20pF 50V C0G/NP0 0402 ±1%; Manufacturer 1: MURATA ELECTRONICS; Manufacturer Part Number 1: GJM1555C1H200FB01D; Location: NA; MSL Level: Level-1; MaxHeight_mm: 0.55; Check: Approved; UnitPrice: 0.1; PackageType: SMD; Tolerance: ±1%; ComponentLink2Description: Datasheet; Status: Active; ComponentLink3Description: DigiKey; ComponentLink3URL: https://www.digikey.com/en/products/detail/murata-electronics/GJM1555C1H200FB01D/2592908; Supplier 1: Digi-Key; Supplier Part Number 1: 490-11204-2-ND
DPX1 DPX2 = DPLX-4254A0+: RF DIPLEXER DC-42/54-1000 MHz NU1620 -40°C~85°C; Manufacturer 1: MINI CIRCUIT; MSL Level: Level-1; MaxHeight_mm: 7.11; M_AmpersPerContact: NA; M_Number_of_Pins: 20; M_RatedPower(W): 1; Check: Approved; Manufacturer Part Number 1: DPLX-4254A0+; Status: Active; PackageType: SMD; Package: NU1620; M_Duty Cycle(%): NA; M_ESR(mΩ): NA; M_Frequency(MHz): NA; M_MatingCycle: NA; M_Number_of_Bits(K): NA; M_Number_of_Transistors_Gates_or_Bits: NA; M_OperatingVoltage(V): NA; M_ProgrammingCycles: NA; Value: DPLX-4254A0+
J6 J7 = DOSIN-803-0130: CONN F PLUG BOARD EDGE 75OHM -40°C~140°C; Manufacturer 1: DOSIN; Location: NA; MaxHeight_mm: 4.75; Check: Approved; ComponentLink1Description: DOSIN; ComponentLink1URL: https://www.dosinconn.com/wp-content/uploads/2022/07/DOSIN-803-0130.pdf; Manufacturer Part Number 1: DOSIN-803-0130; Status: Active; PackageType: SMD; M_Duty Cycle(%): NA; M_ESR(mΩ): NA; M_Frequency(MHz): NA; M_Number_of_Bits(K): NA; M_Number_of_Transistors_Gates_or_Bits: NA; M_OperatingPower(W): NA; M_OperatingVoltage(V): NA; M_ProgrammingCycles: NA; M_RatedPower(W): NA; M_RatedVoltage(V): NA; M_ThermalResistance(θJABC)(°C/W): NA; Package: F TYPE; Value: DOSIN-803-0130
J9-J12 = MS-156C3: COAX SW RF DIA 50OHM SMD -40°C~85°C; Manufacturer 1: HIROSE; Location: NA; MaxHeight_mm: 1.35; Check: Approved; Manufacturer Part Number 1: MS-156C3; Status: Active; PackageType: SMD; ComponentLink2Description: Datasheet; ComponentLink2URL: https://www.digikey.com/en/products/detail/hirose-electric-co-ltd/MS-156C3/5133612?_gl=1*fkpag6*_up*MQ..*_gs*MQ..&gclid=Cj0KCQjwrs7RBhDuARIsAIVfBD2sjkF7JQckfmjgpjtW1QLRvux6_yJsbSrD39rXaoqan7O-Y7Tq6UkaAnthEALw_wcB&gclsrc=aw.ds&gbraid=0AAAAADrbLlhqKD3R2x8SpsFg283DEbllO; M_Duty Cycle(%): NA; M_ESR(mΩ): NA; M_Frequency(MHz): NA; M_Number_of_Bits(K): NA; M_Number_of_Transistors_Gates_or_Bits: NA; M_OperatingPower(W): NA; M_OperatingVoltage(V): NA; M_ProgrammingCycles: NA; M_RatedPower(W): NA; M_RatedVoltage(V): NA; M_ThermalResistance(θJABC)(°C/W): NA; Value: MS-156C3
L4 = L 0805 800mA - 1uH: IND 1uH 800mA 100mΩ DCR 0805 ±20% -55°C~125°C; Manufacturer 1: TDK; Manufacturer Part Number 1: MLZ2012M1R0HTD25; Location: NA; MSL Level: Level-1; MaxHeight_mm: 1.45; Check: Approved; PackageType: SMD; Tolerance: ±20%; Status: Active; Supplier 1: Digi-Key; Supplier Part Number 1: 445-17075-2-ND; ComponentLink1Description: DigiKey; ComponentLink1URL: https://www.digikey.lv/en/products/detail/tdk/MLZ2012M1R0HTD25/4743204
L5 L6 = L 1008 400mA - 820nH: IND 820nH 400mA Q:45@400MHz ±3% 1008 -55°C~125°C; Manufacturer 1: MURATA; Manufacturer Part Number 1: LQW2UASR82J00L; MSL Level: Level-1; Tolerance: ±5%; MaxHeight_mm: 2.03; M_AmpersPerContact: NA; M_Number_of_Pins: 2; Check: Approved; UnitPrice: 0.15; PackageType: SMD; Status: Active; M_Duty Cycle(%): NA; M_ESR(mΩ): NA; M_MatingCycle: NA; M_Number_of_Bits(K): NA; M_Number_of_Transistors_Gates_or_Bits: NA; M_OperatingPower(W): NA; M_OperatingVoltage(V): NA; M_ProgrammingCycles: NA; M_RatedPower(W): NA; M_RatedVoltage(V): NA; ComponentLink3Description: Digikey; ComponentLink3URL: https://www.digikey.lv/en/products/detail/murata-electronics/LQW2UASR82J00L/2674720
L13 = L 0402 310mA - 100nH: IND 100nH 310mA 1.57Ω DCR 0402 ±5% -40°C~125°C; Manufacturer 1: COILCRAFT; Manufacturer Part Number 1: 0402DC-R10XJRW; SAP: 1033601; Location: NA; MSL Level: Level-1; MaxHeight_mm: 0.55; M_Number_of_Pins: 2; Check: Approved; UnitPrice: 0.1; PackageType: SMD; Tolerance: ±5%; ComponentLink2Description: Datasheet; ComponentLink2URL: D:\SAVRONIK_SVN\Donanım\trunk\ALTIUM\Central Library\Datasheets\Inductor\0402DC-R10XJRW_Datasheet.pdf; Status: Active; M_AmpersPerContact: NA; M_Duty Cycle(%): NA; M_ESR(mΩ): NA; M_Frequency(MHz): NA; M_MatingCycle: NA; M_Number_of_Bits(K): NA; M_Number_of_Transistors_Gates_or_Bits: NA; M_OperatingVoltage(V): NA; M_ProgrammingCycles: NA; M_RatedPower(W): NA; M_RatedVoltage(V): NA; M_OperatingPower(W): NA; M_ThermalResistance(θJABC)(°C/W): NA; Supplier 1: Digikey; Supplier Part Number 1: 2457-0402DC-R10XJRW-ND; ComponentLink1Description: Digikey; ComponentLink1URL: https://www.digikey.com/en/products/detail/coilcraft/0402DC-R10XJRW/12714710?_gl=1*8evbuw*_up*MQ..&gclid=EAIaIQobChMI_Lbip9H7hQMVUZdoCR3mHQjgEAAYAiAAEgLOLPD_BwE
L18 = L 0402 1.6A - 9.1nH: IND 9.1nH 1.6A 70mΩ DCR 0402 ±2% -40°C~125°C; Manufacturer 1: COILCRAFT; Manufacturer Part Number 1: 0402DC-9N1XGRW; SAP: 1027917; Location: NA; MSL Level: Level-1; MaxHeight_mm: 0.5; M_Number_of_Pins: 2; Check: Approved; UnitPrice: 0.1; PackageType: SMD; Tolerance: ±2%; ComponentLink2Description: Datasheet; ComponentLink2URL: D:\SAVRONIK_SVN\Donanım\trunk\ALTIUM\Central Library\Datasheets\Inductor\0402DC-9N1XGRW_Datasheet.pdf; Status: Active; M_AmpersPerContact: NA; M_Duty Cycle(%): NA; M_ESR(mΩ): NA; M_Frequency(MHz): NA; M_MatingCycle: NA; M_Number_of_Bits(K): NA; M_Number_of_Transistors_Gates_or_Bits: NA; M_OperatingVoltage(V): NA; M_ProgrammingCycles: NA; M_RatedPower(W): NA; M_RatedVoltage(V): NA; M_OperatingPower(W): NA; M_ThermalResistance(θJABC)(°C/W): NA; Supplier 1: Digikey; Supplier Part Number 1: 2457-0402DC-9N1XGRW-ND; ComponentLink1Description: Digikey; ComponentLink1URL: https://www.digikey.com/en/products/detail/coilcraft/0402DC-9N1XGRW/12714547
L19 = L 0402 650mA - 5.6nH: IND 5.6nH 650mA 200mΩ DCR 0402 ±0.3nH -55°C~125°C; Manufacturer 1: MURATA ELECTRONICS; Manufacturer Part Number 1: LQG15HS5N6S02D; Location: NA; MSL Level: Level-1; MaxHeight_mm: 0.6; M_Number_of_Pins: 2; Check: Approved; UnitPrice: 0.1; PackageType: SMD; Tolerance: ±0.3nH; ComponentLink2Description: Datasheet; ComponentLink2URL: D:\SAVRONIK_SVN\Donanım\trunk\ALTIUM\Central Library\Datasheets\Inductor\LQG15HS5N6S02D_Datasheet.pdf; Status: Active; M_AmpersPerContact: NA; M_Duty Cycle(%): NA; M_ESR(mΩ): NA; M_Frequency(MHz): NA; M_MatingCycle: NA; M_Number_of_Bits(K): NA; M_Number_of_Transistors_Gates_or_Bits: NA; M_OperatingVoltage(V): NA; M_ProgrammingCycles: NA; M_RatedPower(W): NA; M_RatedVoltage(V): NA; M_OperatingPower(W): NA; M_ThermalResistance(θJABC)(°C/W): NA; Supplier 1: Digikey; Supplier Part Number 1: 490-2619-2-ND; ComponentLink1Description: Digikey; ComponentLink1URL: https://www.digikey.com/en/products/detail/murata-electronics/LQG15HS5N6S02D/662868?s=N4IgTCBcDaIDIEUDiBGArACQMpoHIDYsAGMAERAF0BfIA
R5 = R 0402 1/10W 1% - 100R: RES 100R 1/10W 0402 1%; Manufacturer 1: PANASONIC ELECTRONIC COMPONENTS; Manufacturer Part Number 1: ERJ-2RKF1000X; Location: NA; MSL Level: Level-1; MaxHeight_mm: 0.4; Check: Approved; ComponentLink1Description: Digi-Key; ComponentLink1URL: https://www.digikey.com/en/products/detail/panasonic-electronic-components/ERJ-2RKF1000X/192080?utm_adgroup=&utm_source=google&utm_medium=cpc&utm_campaign=Pmax_Product_All%20Products&utm_term=&utm_content=&utm_id=go_cmp-18790247214_adg-_ad-__dev-c_ext-_prd-_sig-EAIaIQobChMIqPWSmvPUggMVK5JoCR2T3g0zEAAYASAAEgI7GvD_BwE&gad_source=1&gclid=EAIaIQobChMIqPWSmvPUggMVK5JoCR2T3g0zEAAYASAAEgI7GvD_BwE; UnitPrice: 0.1; PackageType: SMD; Tolerance: ±1%; ComponentLink2Description: Datasheet; Status: Active
R6 = R 0402 1/10W 1% - 820R: RES 820R 1/10W 0402 1%; Manufacturer 1: KOA SPEER ELECTRONICS, INC.; Manufacturer Part Number 1: RK73H1ETTP8200F; Location: NA; MSL Level: Level-1; MaxHeight_mm: 0.4; Check: Approved; M_Number_of_Pins: 2; M_RatedPower(W): 0.1; UnitPrice: 0.1; PackageType: SMD; Tolerance: ±1%; Status: Active; M_AmpersPerContact: NA; M_Duty Cycle(%): NA; M_ESR(mΩ): NA; M_Frequency(MHz): NA; M_MatingCycle: NA; M_Number_of_Bits(K): NA; M_Number_of_Transistors_Gates_or_Bits: NA; M_OperatingVoltage(V): NA; M_ProgrammingCycles: NA; M_RatedVoltage(V): NA; M_ThermalResistance(θJABC)(°C/W): NA; Supplier 1: Digikey; Supplier Part Number 1: 2019-RK73H1ETTP8200FTR-ND
R49 R80 R81 = R 0402 1/10W 1% - 5R6: RES 5R6 1/10W 0402 1%; Manufacturer 1: KOA SPEER ELECTRONICS, INC.; Manufacturer Part Number 1: RK73H1ETTP5R60F; Location: NA; MSL Level: Level-1; MaxHeight_mm: 0.4; Check: Approved; M_Number_of_Pins: 2; M_RatedPower(W): 0.1; UnitPrice: 0.1; PackageType: SMD; Tolerance: ±1%; Status: Active; M_AmpersPerContact: NA; M_Duty Cycle(%): NA; M_ESR(mΩ): NA; M_Frequency(MHz): NA; M_MatingCycle: NA; M_Number_of_Bits(K): NA; M_Number_of_Transistors_Gates_or_Bits: NA; M_OperatingVoltage(V): NA; M_ProgrammingCycles: NA; M_RatedVoltage(V): NA; M_ThermalResistance(θJABC)(°C/W): NA; Supplier 1: Digikey; Supplier Part Number 1: 2019-RK73H1ETTP5R60FTR-ND
R50 R51 R82-R85 = R 0402 1/10W 1% - 866R: RES 866R 1/10W 0402 1%; Manufacturer 1: KOA SPEER ELECTRONICS, INC.; Manufacturer Part Number 1: RK73H1ETTP8660F; Location: NA; MSL Level: Level-1; MaxHeight_mm: 0.4; Check: Approved; M_Number_of_Pins: 2; M_RatedPower(W): 0.1; UnitPrice: 0.1; PackageType: SMD; Tolerance: ±1%; Status: Active; M_AmpersPerContact: NA; M_Duty Cycle(%): NA; M_ESR(mΩ): NA; M_Frequency(MHz): NA; M_MatingCycle: NA; M_Number_of_Bits(K): NA; M_Number_of_Transistors_Gates_or_Bits: NA; M_OperatingVoltage(V): NA; M_ProgrammingCycles: NA; M_RatedVoltage(V): NA; M_ThermalResistance(θJABC)(°C/W): NA; Supplier 1: Digikey; Supplier Part Number 1: 2019-RK73H1ETTP8660FTR-ND
R52-R54 R58 R59 R72 R74-R79 R125-R128 = R 0402 1/10W - 0R: RES 0R 1/10W 0402; Manufacturer 1: PANASONIC ELECTRONIC COMPONENTS; Manufacturer Part Number 1: ERJ-2GE0R00X; SAP: 1014381; Location: NA; MSL Level: Level-1; MaxHeight_mm: 0.4; Check: Approved; M_Number_of_Pins: 2; M_RatedPower(W): 0.1; ComponentLink1Description: Digi-Key; ComponentLink1URL: https://www.digikey.com/en/products/detail/panasonic-electronic-components/ERJ-2GE0R00X/146727?utm_adgroup=&utm_source=google&utm_medium=cpc&utm_campaign=Pmax_Product_All%20Products&utm_term=&utm_content=&utm_id=go_cmp-18790247214_adg-_ad-__dev-c_ext-_prd-_sig-EAIaIQobChMI6dXOvs-qgwMVM4loCR0TKwG5EAAYASAAEgIbCfD_BwE&gad_source=1&gclid=EAIaIQobChMI6dXOvs-qgwMVM4loCR0TKwG5EAAYASAAEgIbCfD_BwE; UnitPrice: 0.1; PackageType: SMD; Status: Active; ComponentLink2Description: Datasheet; ComponentLink2URL: D:\SAVRONIK_SVN\Donanım\trunk\ALTIUM\Central Library\Datasheets\Resistor\ERJ-2GE0R00X_Datasheet.pdf; M_AmpersPerContact: NA; M_Duty Cycle(%): NA; M_ESR(mΩ): NA; M_Frequency(MHz): NA; M_MatingCycle: NA; M_Number_of_Bits(K): NA; M_Number_of_Transistors_Gates_or_Bits: NA; M_OperatingVoltage(V): NA; M_ProgrammingCycles: NA; M_RatedVoltage(V): NA; M_ThermalResistance(θJABC)(°C/W): NA; Supplier 1: Digikey; Supplier Part Number 1: P0.0JTR-ND
R56 R60-R66 R69-R71 = R 0402 1/10W 1% - 10K: RES 10K 1/10W 0402 1%; Manufacturer 1: PANASONIC ELECTRONIC COMPONENTS; Manufacturer Part Number 1: ERJ-2RKF1002X; Location: NA; MSL Level: Level-1; MaxHeight_mm: 0.4; Check: Approved; ComponentLink1Description: Digi-Key; ComponentLink1URL: https://www.digikey.com/en/products/detail/panasonic-electronic-components/ERJ-2RKF1002X/192073; UnitPrice: 0.1; PackageType: SMD; Tolerance: ±1%; ComponentLink2Description: Datasheet; Status: Active; Supplier 1: Digikey; Supplier Part Number 1: P10.0KLTR-ND
  R64-R66 R69-R71: M_AmpersPerContact: NA; M_Duty Cycle(%): NA; M_Frequency(MHz): NA; M_MatingCycle: NA; M_Number_of_Bits(K): NA; M_Number_of_Transistors_Gates_or_Bits: NA; M_OperatingVoltage(V): NA; M_ProgrammingCycles: NA
R86 R94 = R 0402 1/10W 1% - 270R: RES 270R 1/10W 0402 1%; Manufacturer 1: KOA SPEER ELECTRONICS, INC.; Manufacturer Part Number 1: RK73H1ETTP2700F; Location: NA; MSL Level: Level-1; MaxHeight_mm: 0.4; Check: Approved; M_Number_of_Pins: 2; M_RatedPower(W): 0.1; UnitPrice: 0.1; PackageType: SMD; Tolerance: ±1%; Status: Active; M_AmpersPerContact: NA; M_Duty Cycle(%): NA; M_ESR(mΩ): NA; M_Frequency(MHz): NA; M_MatingCycle: NA; M_Number_of_Bits(K): NA; M_Number_of_Transistors_Gates_or_Bits: NA; M_OperatingVoltage(V): NA; M_ProgrammingCycles: NA; M_RatedVoltage(V): NA; M_ThermalResistance(θJABC)(°C/W): NA; Supplier 1: Digikey
R87 R95 = R 0402 1/10W 1% - 200R: RES 200R 1/10W 0402 1%; Manufacturer 1: KOA SPEER ELECTRONICS, INC.; Manufacturer Part Number 1: RK73H1ETTP2000F; Location: NA; MSL Level: Level-1; MaxHeight_mm: 0.4; Check: Approved; M_Number_of_Pins: 2; M_RatedPower(W): 0.1; ComponentLink1Description: Digi-Key; ComponentLink1URL: https://www.digikey.com/en/products/detail/koa-speer-electronics-inc/RK73H1ETTP2000F/9844174; UnitPrice: 0.1; PackageType: SMD; Tolerance: ±1%; ComponentLink2Description: Datasheet; ComponentLink2URL: D:\IFF\IFF_Library\Datasheets\Resistor\RK73H1ETTP2800F_Datasheet.pdf; Status: Active; M_AmpersPerContact: NA; M_Duty Cycle(%): NA; M_ESR(mΩ): NA; M_Frequency(MHz): NA; M_MatingCycle: NA; M_Number_of_Bits(K): NA; M_Number_of_Transistors_Gates_or_Bits: NA; M_OperatingVoltage(V): NA; M_ProgrammingCycles: NA; M_RatedVoltage(V): NA; M_ThermalResistance(θJABC)(°C/W): NA; Supplier 1: Digikey; Supplier Part Number 1: 2019-RK73H1ETTP2000FTR-ND
R88 R89 R92 R93 = R 0805 1/2W 1% - 10R: RES 10R 1/2W 0805 1%; Manufacturer 1: VISHAY DALE; Manufacturer Part Number 1: CRCW080510R0FKEAHP; Location: NA; MSL Level: Level-1; MaxHeight_mm: 0.58; M_Number_of_Pins: 2; M_RatedPower(W): 0.25; Check: Approved; ComponentLink1Description: Digi-Key; ComponentLink1URL: https://www.digikey.com/en/products/detail/vishay-dale/CRCW080510R0FKEAHP/2222320; UnitPrice: 0.18; PackageType: SMD; Tolerance: ±1%; ComponentLink2Description: Datasheet; ComponentLink2URL: D:\IFF\IFF_Library\Datasheets\Resistor\CRCW080510R0FKEAHP_Datasheet.pdf; Status: Active; M_AmpersPerContact: NA; M_Duty Cycle(%): NA; M_ESR(mΩ): NA; M_Frequency(MHz): NA; M_MatingCycle: NA; M_Number_of_Bits(K): NA; M_Number_of_Transistors_Gates_or_Bits: NA; M_OperatingPower(W): NA; M_OperatingTemperatureRange(-°C/+°C): -55/155; M_OperatingVoltage(V): NA; M_ProgrammingCycles: NA; M_RatedVoltage(V): NA; M_ThermalResistance(θJABC)(°C/W): NA; Supplier 1: Digi-Key; Supplier Part Number 1: 541-10.0TTR-ND
R90 R91 = R 0402 1/10W 1% - 1K: RES 1K 1/10W 0402 1%; Manufacturer 1: PANASONIC ELECTRONIC COMPONENTS; Manufacturer Part Number 1: ERJ-2RKF1001X; Location: NA; MSL Level: Level-1; MaxHeight_mm: 0.4; Check: Approved; ComponentLink1Description: Digi-Key; ComponentLink1URL: https://www.digikey.com/en/products/detail/panasonic-electronic-components/ERJ-2RKF1001X/79729?s=N4IgTCBcDaIEoCkC0Y4GkBiBGADDrAGiALoC%2BQA; UnitPrice: 0.1; PackageType: SMD; Tolerance: ±1%; ComponentLink2Description: Datasheet; Status: Active; Supplier 1: Digikey; Supplier Part Number 1: P1.00KLTR-ND
R106 R132 R133 = R 0402 1/10W - 0R: RES 0R 1/10W 0402; Manufacturer 1: PANASONIC ELECTRONIC COMPONENTS; Manufacturer Part Number 1: ERJ-2GE0R00X; Location: NA; MSL Level: Level-1; MaxHeight_mm: 0.4; Check: Approved; ComponentLink1Description: Digi-Key; ComponentLink1URL: https://www.digikey.com/en/products/detail/panasonic-electronic-components/ERJ-2GE0R00X/146727?utm_adgroup=&utm_source=google&utm_medium=cpc&utm_campaign=Pmax_Product_All%20Products&utm_term=&utm_content=&utm_id=go_cmp-18790247214_adg-_ad-__dev-c_ext-_prd-_sig-EAIaIQobChMI6dXOvs-qgwMVM4loCR0TKwG5EAAYASAAEgIbCfD_BwE&gad_source=1&gclid=EAIaIQobChMI6dXOvs-qgwMVM4loCR0TKwG5EAAYASAAEgIbCfD_BwE; UnitPrice: 0.1; PackageType: SMD; Status: Active; ComponentLink2Description: Datasheet; Supplier 1: Digikey; Supplier Part Number 1: P0.0JTR-ND
R107 = R 0402 1/10W 1% - 10R: RES 10R 1/10W 0402 1%; Manufacturer 1: PANASONIC ELECTRONIC COMPONENTS; Manufacturer Part Number 1: ERJ-2RKF10R0X; Location: NA; MSL Level: Level-1; MaxHeight_mm: 0.4; Check: Approved; ComponentLink1Description: Digi-Key; ComponentLink1URL: https://www.digikey.com/en/products/detail/panasonic-electronic-components/erj-2rkf10r0x/192072; UnitPrice: 0.1; PackageType: SMD; Tolerance: ±1%; ComponentLink2Description: Datasheet; Status: Active; Supplier 1: Digikey; Supplier Part Number 1: P10.0LTR-ND
R108 R109 R114 = R 0402 1/10W 1% - 51R: RES 51R 1/10W 0402 1%; Manufacturer 1: KOA SPEER ELECTRONICS, INC.; Manufacturer Part Number 1: RK73H1ETTP51R0F; Location: NA; MSL Level: Level-1; MaxHeight_mm: 0.4; Check: Approved; M_Number_of_Pins: 2; M_RatedPower(W): 0.1; UnitPrice: 0.1; PackageType: SMD; Tolerance: ±1%; Status: Active; M_AmpersPerContact: NA; M_Duty Cycle(%): NA; M_ESR(mΩ): NA; M_Frequency(MHz): NA; M_MatingCycle: NA; M_Number_of_Bits(K): NA; M_Number_of_Transistors_Gates_or_Bits: NA; M_OperatingVoltage(V): NA; M_ProgrammingCycles: NA; M_RatedVoltage(V): NA; M_ThermalResistance(θJABC)(°C/W): NA; Supplier 1: Digikey; Supplier Part Number 1: 2019-RK73H1ETTP51R0FTR-ND
U5 U19 = DBTC-10-4-75+: RF Dir. Coupler 5-1000 MHz SMD 75 OHM -40°C~85°C; Manufacturer 1: Mini Circuit; Location: NA; MSL Level: Level-1; MaxHeight_mm: 3.81; Check: Approved; Manufacturer Part Number 1: DBTC-10-4-75+; UnitPrice: 2.6; Status: Active; PackageType: SMD; Package: AT790-1; M_AmpersPerContact: NA; M_Duty Cycle(%): NA; M_ESR(mΩ): NA; M_Frequency(MHz): NA; M_MatingCycle: NA; M_OperatingVoltage(V): NA; M_RatedVoltage(V): NA; Value: DBTC-10-4-75+
U6 = AE427: IC RF AMP 5-1000MHz GAIN 25dB NF 2dB OIP3 41dBm SOT-89 -40°C~85°C; Manufacturer 1: RFHIC; Location: NA; MSL Level: Level-1; MaxHeight_mm: 1.5; M_Number_of_Pins: 3; Check: Approved; Manufacturer Part Number 1: AE427; Status: Active; PackageType: SMD; ComponentLink2Description: Datasheet; ComponentLink2URL: https://rfhic.com/wp-content/uploads/2024/01/AE427-25dB-5-1000-MHz-GaAs-MMIC.datasheet-download.pdf; Package: SOT-89; M_AmpersPerContact: NA; M_Duty Cycle(%): NA; M_ESR(mΩ): NA; M_Frequency(MHz): NA; M_MatingCycle: NA; M_Number_of_Bits(K): NA; M_Number_of_Transistors_Gates_or_Bits: NA; M_OperatingVoltage(V): NA; M_ProgrammingCycles: NA; M_RatedPower(W): NA; M_RatedVoltage(V): NA; M_OperatingPower(W): NA; M_ThermalResistance(θJABC)(°C/W): NA; ComponentLink3Description: RFHIC; ComponentLink3URL: https://rfhic.com/product/gaas-mmic-25db-5-1000-mhz-wireless-infrastructure-ae427/; Value: AE427
U10 = PE4312C-Z: IC RF ATTENUATOR 0.5dB-31.5dB 0.001-4GHz 20-QFN -40°C~85°C; Manufacturer 1: PSEMI; SAP: NA; MSL Level: Level-1; MaxHeight_mm: 1; M_Number_of_Pins: 20; Check: Approved; Location: NA; Manufacturer Part Number 1: PE4312C-Z; Status: Active; PackageType: SMD; Package: 20-QFN; M_AmpersPerContact: NA; M_Duty Cycle(%): NA; M_ESR(mΩ): NA; M_Frequency(MHz): NA; M_MatingCycle: NA; M_Number_of_Bits(K): NA; M_Number_of_Transistors_Gates_or_Bits: NA; M_OperatingVoltage(V): NA; M_ProgrammingCycles: NA; M_RatedPower(W): NA; M_RatedVoltage(V): NA; M_OperatingPower(W): NA; M_ThermalResistance(θJABC)(°C/W): NA; Value: PE4312C-Z
U12 U15 = TC1.5-1+: RF Balun 0.5-2200 MHz SMD 1:1.5 -20°C~85°C; Manufacturer 1: Mini Circuit; Location: NA; MSL Level: Level-1; MaxHeight_mm: 4.06; Check: Approved; Manufacturer Part Number 1: TC1.5-1+; Status: Active; PackageType: SMD; Package: AT1521; M_AmpersPerContact: NA; M_Duty Cycle(%): NA; M_ESR(mΩ): NA; M_Frequency(MHz): NA; M_MatingCycle: NA; M_OperatingVoltage(V): NA; M_RatedVoltage(V): NA; Value: TC1.5-1+
U13 U14 = PE42462A-X: IC RF SWITCH B 0.01-8GHz 24-QFN -55°C~105°C; Manufacturer 1: PSEMI; SAP: NA; MSL Level: Level-1; MaxHeight_mm: 1; M_Number_of_Pins: 24; Check: Approved; Location: NA; Manufacturer Part Number 1: PE42462A-X; Status: Active; PackageType: SMD; Package: 24-QFN; M_AmpersPerContact: NA; M_Duty Cycle(%): NA; M_ESR(mΩ): NA; M_Frequency(MHz): NA; M_MatingCycle: NA; M_Number_of_Bits(K): NA; M_Number_of_Transistors_Gates_or_Bits: NA; M_OperatingVoltage(V): NA; M_ProgrammingCycles: NA; M_RatedPower(W): NA; M_RatedVoltage(V): NA; M_OperatingPower(W): NA; M_ThermalResistance(θJABC)(°C/W): NA; Value: PE42462A-X
U16 U18 = TC1-1-13M+: RF Balun 0.5-2200 MHz SMD 1:1 -40°C~85°C; Manufacturer 1: Mini Circuit; Location: NA; MSL Level: Level-1; MaxHeight_mm: 4.06; Check: Approved; Manufacturer Part Number 1: TC1-1-13M+; Status: Active; PackageType: SMD; Package: AT1521; M_AmpersPerContact: NA; M_Duty Cycle(%): NA; M_ESR(mΩ): NA; M_Frequency(MHz): NA; M_MatingCycle: NA; M_OperatingVoltage(V): NA; M_RatedVoltage(V): NA; Value: TC1-1-13M+
U17 = AE618: IC RF AMP 30-1000MHz GAIN 20dB NF 2.5dB OIP3 44dBm SOIC-8 -40°C~85°C; Manufacturer 1: RFHIC; Location: NA; MSL Level: Level-1; MaxHeight_mm: 1.5; M_Number_of_Pins: 8; Check: Approved; Manufacturer Part Number 1: AE618; Status: Active; PackageType: SMD; ComponentLink2Description: Datasheet; ComponentLink2URL: https://rfhic.com/wp-content/uploads/2024/05/AE618_V1.4-20dB-5-1300-MHz-GaAs-MMIC.datasheet-download.pdf; Package: SOIC-8; M_AmpersPerContact: NA; M_Duty Cycle(%): NA; M_ESR(mΩ): NA; M_Frequency(MHz): NA; M_MatingCycle: NA; M_Number_of_Bits(K): NA; M_Number_of_Transistors_Gates_or_Bits: NA; M_OperatingVoltage(V): NA; M_ProgrammingCycles: NA; M_RatedPower(W): NA; M_RatedVoltage(V): NA; M_OperatingPower(W): NA; M_ThermalResistance(θJABC)(°C/W): NA; ComponentLink3Description: RFHIC; ComponentLink3URL: https://rfhic.com/product/gaas-mmic-20db-5-1300-mhz-wireless-infrastructure-ae618/; Value: AE618